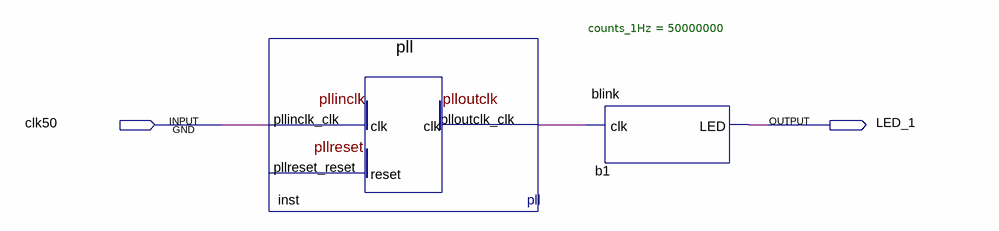
[diagram p0: schematic sheet]
// Quartus schematic blinkdev.bdf as structural Verilog: 2 symbols, 2 pins
module blinkdev (
  input  clk50,
  output LED_1
);

  wire inst_plloutclk_clk;

  pll inst (.pllinclk_clk(clk50), .plloutclk_clk(inst_plloutclk_clk));  // open: pllreset_reset
  blink #(.counts_1Hz(50000000)) b1 (.clk(inst_plloutclk_clk), .LED(LED_1));
endmodule
